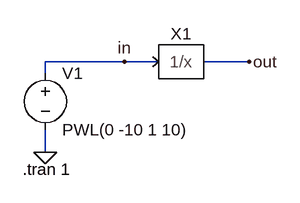
[diagram p0: schematic INVERSE_test.asc]
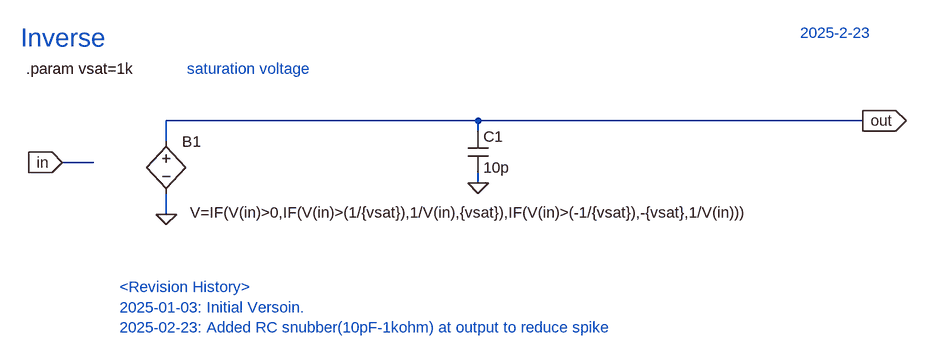
[diagram p1: sub-circuit inverse.asc]
INVERSE_test.asc, the LTspice schematic file:
Version 4
SHEET 1 880 680
WIRE 80 176 -32 176
WIRE 128 176 80 176
WIRE 256 176 192 176
WIRE -32 192 -32 176
WIRE -32 304 -32 272
FLAG 256 176 out
FLAG 80 176 in
FLAG -32 304 0
SYMBOL PowerSim\\INVERSE 160 176 R0
SYMATTR InstName X1
SYMBOL voltage -32 176 R0
WINDOW 123 0 0 Left 0
WINDOW 39 0 0 Left 0
SYMATTR InstName V1
SYMATTR Value PWL(0 -10 1 10)
TEXT -64 328 Left 2 !.tran 1

inverse.asc, the sub-circuit schematic file:
Version 4
SHEET 1 1360 680
WIRE 672 144 192 144
WIRE 1264 144 672 144
WIRE 672 160 672 144
WIRE 192 176 192 144
WIRE 80 208 32 208
WIRE 672 240 672 224
WIRE 192 288 192 256
FLAG 32 208 in
IOPIN 32 208 In
FLAG 192 288 0
FLAG 1264 144 out
IOPIN 1264 144 Out
FLAG 672 240 0
SYMBOL bv 192 160 R0
WINDOW 3 37 125 Left 2
SYMATTR Value V=IF(V(in)>0,IF(V(in)>(1/{vsat}),1/V(in),{vsat}),IF(V(in)>(-1/{vsat}),-{vsat},1/V(in)))
SYMATTR InstName B1
SYMBOL cap 656 160 R0
SYMATTR InstName C1
SYMATTR Value 10p
SYMATTR SpiceLine Rser=1k
TEXT -32 16 Left 4 ;Inverse
TEXT 1168 8 Left 2 ;2025-2-23
TEXT -24 64 Left 2 !.param vsat=1k
TEXT 224 64 Left 2 ;saturation voltage
TEXT 120 400 Left 2 ;<Revision History>\n2025-01-03: Initial Versoin.\n2025-02-23: Added RC snubber(10pF-1kohm) at output to reduce spike

The netlist it stands for:
* INVERSE_test.asc
XX1 in out inverse
V1 in 0 PWL(0 -10 1 10)

* block symbol definitions
.subckt inverse in out
B1 out 0 V=IF(V(in)>0,IF(V(in)>(1/{vsat}),1/V(in),{vsat}),IF(V(in)>(-1/{vsat}),-{vsat},1/V(in)))
C1 out 0 10p Rser=1k
* Inverse
* 2025-2-23
.param vsat=1k
* saturation voltage
* <Revision History>
* 2025-01-03: Initial Versoin.
* 2025-02-23: Added RC snubber(10pF-1kohm) at output to reduce spike
.ends inverse

.tran 1
.backanno
.end